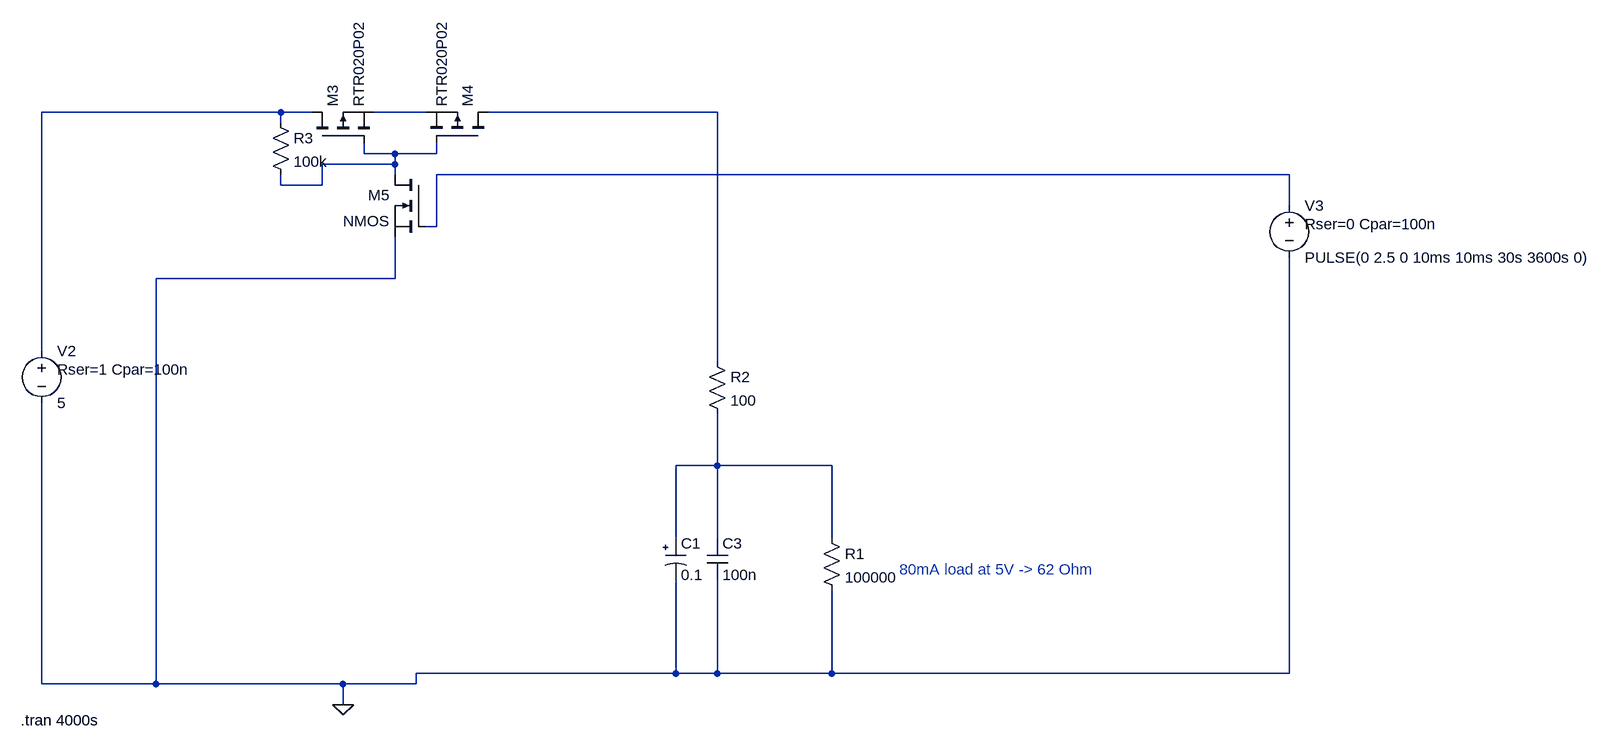
[diagram p0: schematic supercap.asc]
supercap.asc, the LTspice schematic file:
Version 4
SHEET 1 1864 680
WIRE -176 -480 -544 -480
WIRE -128 -480 -176 -480
WIRE 48 -480 -32 -480
WIRE 496 -480 144 -480
WIRE -176 -464 -176 -480
WIRE -48 -416 -48 -432
WIRE 0 -416 -48 -416
WIRE 64 -416 64 -432
WIRE 64 -416 0 -416
WIRE 0 -400 0 -416
WIRE 0 -400 -112 -400
WIRE 0 -384 0 -400
WIRE 1376 -384 64 -384
WIRE -176 -368 -176 -384
WIRE -112 -368 -112 -400
WIRE -112 -368 -176 -368
WIRE 1376 -336 1376 -384
WIRE 64 -304 64 -384
WIRE 64 -304 48 -304
WIRE 0 -224 0 -288
WIRE 0 -224 -368 -224
WIRE -544 -112 -544 -480
WIRE 496 -96 496 -480
WIRE 496 64 496 -16
WIRE 496 64 432 64
WIRE 672 64 496 64
WIRE 432 176 432 64
WIRE 496 176 496 64
WIRE 672 176 672 64
WIRE 432 384 432 240
WIRE 432 384 32 384
WIRE 496 384 496 240
WIRE 496 384 432 384
WIRE 672 384 672 256
WIRE 672 384 496 384
WIRE 1376 384 1376 -256
WIRE 1376 384 672 384
WIRE -544 400 -544 -32
WIRE -368 400 -368 -224
WIRE -368 400 -544 400
WIRE -80 400 -368 400
WIRE 32 400 32 384
WIRE 32 400 -80 400
WIRE -80 432 -80 400
FLAG -80 432 0
SYMBOL voltage -544 -128 R0
WINDOW 123 0 0 Left 0
WINDOW 39 24 44 Left 2
SYMATTR SpiceLine Rser=1 Cpar=100n
SYMATTR InstName V2
SYMATTR Value 5
SYMBOL res 656 160 R0
SYMATTR InstName R1
SYMATTR Value 100000
SYMBOL cap 480 176 R0
SYMATTR InstName C3
SYMATTR Value 100n
SYMBOL pmos -128 -432 R270
SYMATTR InstName M3
SYMATTR Value RTR020P02
SYMBOL pmos 144 -432 M270
SYMATTR InstName M4
SYMATTR Value RTR020P02
SYMBOL voltage 1376 -352 R0
WINDOW 123 0 0 Left 0
WINDOW 39 24 44 Left 2
SYMATTR SpiceLine Rser=0 Cpar=100n
SYMATTR InstName V3
SYMATTR Value PULSE(0 2.5 0 10ms 10ms 30s 3600s 0)
SYMBOL nmos 48 -384 M0
SYMATTR InstName M5
SYMBOL res -192 -480 R0
SYMATTR InstName R3
SYMATTR Value 100k
SYMBOL polcap 416 176 R0
WINDOW 3 24 56 Left 2
SYMATTR Value 0.1
SYMATTR InstName C1
SYMATTR Description Capacitor
SYMATTR Type cap
SYMATTR SpiceLine V=5.5 Irms=2.86 Rser=75 Lser=0
SYMBOL res 480 -112 R0
SYMATTR InstName R2
SYMATTR Value 100
TEXT -576 456 Left 2 !.tran 4000s
TEXT 776 224 Left 2 ;80mA load at 5V -> 62 Ohm

The netlist it stands for:
* supercap.asc
V2 N001 0 5 Rser=1 Cpar=100n
R1 N006 0 100000
C3 N006 0 100n
M3 N001 N004 N002 N002 RTR020P02
M4 N003 N004 N002 N002 RTR020P02
V3 N005 0 PULSE(0 2.5 0 10ms 10ms 30s 3600s 0) Rser=0 Cpar=100n
M5 N004 N005 0 0 NMOS
R3 N001 N004 100k
C1 N006 0 0.1 V=5.5 Irms=2.86 Rser=75 Lser=0
R2 N003 N006 100
.model NMOS NMOS
.model PMOS PMOS
.lib standard.mos
.tran 4000s
* 80mA load at 5V -> 62 Ohm
.backanno
.end